# Altium project HX711.PrjPcb
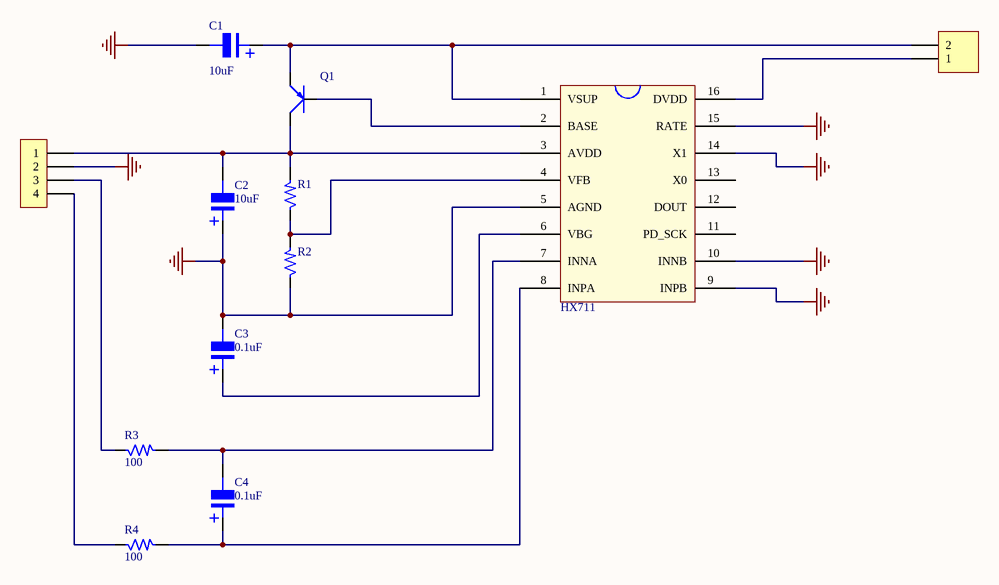
[diagram p0: HX711.SchDoc]
1 sheet, 12 parts. Net scope: global (net labels, ports and power ports of the same name join across sheets).
Board file: HX711.PcbDoc

## Sheet HX711.SchDoc
size A0; SheetNumber: 1; SheetTotal: 1

### Parts
*  HX711  [HX711]
C1  10uF  [tu nhom 4 (b)]
C2  10uF  [tu nhom 4 (b)]
C3  0.1uF  [tu nhom 4 (b)]
C4  0.1uF  [tu nhom 4 (B)]
H1  Header 4P 2.54 Duc Cong  [Header 4P DC 2.54]  (value not drawn)
JP1  Header 2_1  [HED2]  (value not drawn)
Q1  BA  [SOT23]  (value not drawn)
R1  100  [SM-RES-1206]  (value not drawn)
R2  100  [SM-RES-1206]  (value not drawn)
R3  100  [SM-RES-1206]
R4  100  [SM-RES-1206]

### Nets
GND: *.5(AGND) *.9(INPB) *.10(INNB) *.14(X1) *.15(RATE) C1.2 C2.1 C3.2 H1.2 R2.1
Net*_1: *.1(VSUP) C1.1 JP1.2 Q1.2(E)
Net*_2: *.2(BASE) Q1.1(B)
Net*_3: *.3(AVDD) C2.2 H1.1 Q1.3(C) R1.2
Net*_4: *.4(VFB) R1.1 R2.2
Net*_6: *.6(VBG) C3.1
Net*_7: *.7(INNA) C4.2 R3.2
Net*_8: *.8(INPA) C4.1 R4.2
Net*_16: *.16(DVDD) JP1.1
NetH1_3: H1.3 R3.1
NetH1_4: H1.4 R4.1

Not connected (* = marked no-connect by the designer): * 11(PD_SCK) 12(DOUT) 13(X0)

### Notes on the sheet
- (in symbol Tu Nhom 1uF 50V) +
- (in symbol Tu Nhom 10uF 16V) +

### Library data of the parts
C1-C3 = Tu Nhom 10uF 16V: Dán; Don_Vi: Con; So_Chan: 2; Ten_Linh_Kien: Tụ Nhôm 10uF 16V 4x5MM; Ma_Hang: MH001458; Chung_Loai: Dán; Kieu_Chan: *
C4 = Tu Nhom 1uF 50V: Dán; Don_Vi: Con; So_Chan: 2; Ten_Linh_Kien: Tụ Nhôm 1uF 50V 4x5.4MM; Ma_Hang: MH007467; Chung_Loai: Dán; Kieu_Chan: *
H1 = Header 4P 2.54 Duc Cong: Cắm; Ten_Linh_Kien: Header 4P XH2.54-4P Đực Cong; Don_Vi: Con; Ma_Hang: MH001310; Chung_Loai: Cắm
JP1 = Header 2_1: Header, 2-Pin; Manufacturer: Generic Components; Class: Connector; Value: Header 2
Q1 = A1015 BA SMD: PNP 600mW, ECB
R1-R4 = R: Resistor 1/4W; Value: R1/4W - 1K